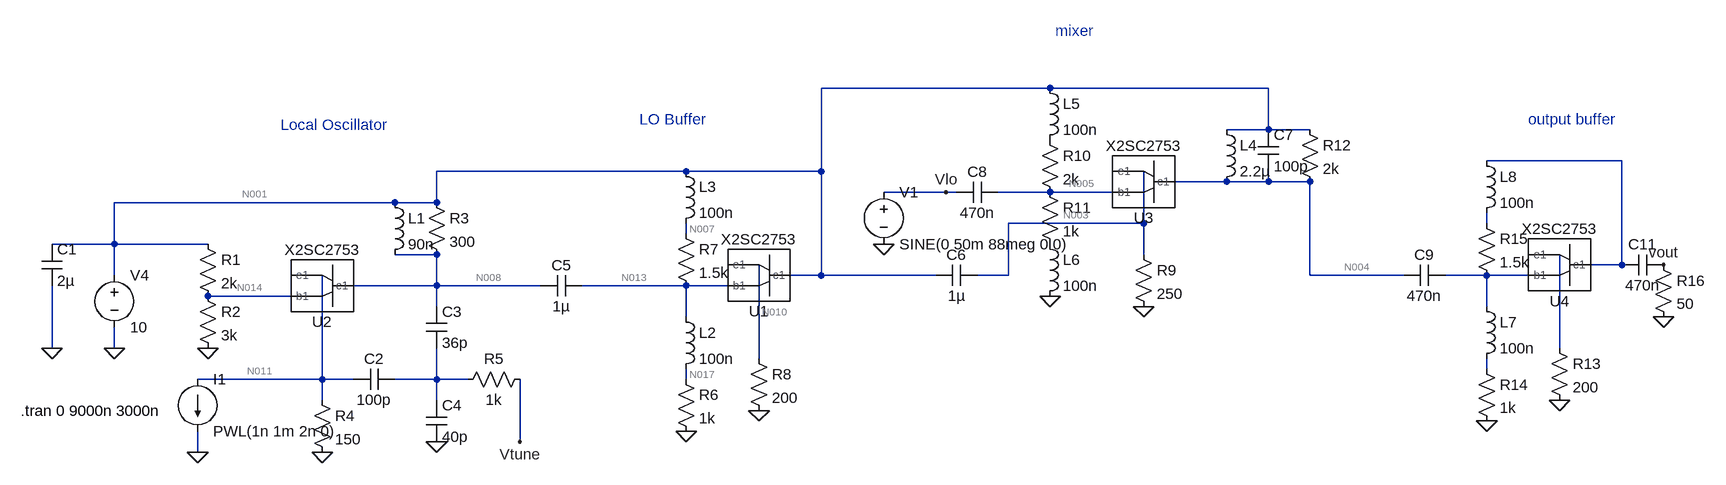
[diagram p0: schematic Lab 3 final.asc]
Lab 3 final.asc, the LTspice schematic file:
Version 4
SHEET 1 3088 680
WIRE 2096 -160 1744 -160
WIRE 2432 -160 2096 -160
WIRE 2432 -96 2432 -160
WIRE 2432 -96 2368 -96
WIRE 2496 -96 2432 -96
WIRE 2976 -48 2768 -48
WIRE 1536 -32 1152 -32
WIRE 1744 -32 1744 -160
WIRE 1744 -32 1536 -32
WIRE 2240 -32 2192 -32
WIRE 2368 -16 2288 -16
WIRE 2432 -16 2432 -32
WIRE 2432 -16 2368 -16
WIRE 2496 -16 2432 -16
WIRE 1936 0 1840 0
WIRE 1952 0 1936 0
WIRE 2096 0 2016 0
WIRE 2192 0 2096 0
WIRE 1088 16 656 16
WIRE 1152 16 1152 -32
WIRE 1152 16 1088 16
WIRE 2240 48 2240 -32
WIRE 2240 48 2032 48
WIRE 2768 48 2768 32
WIRE 1536 64 1536 48
WIRE 656 80 656 16
WIRE 656 80 560 80
WIRE 800 80 656 80
WIRE 1152 96 1088 96
WIRE 2240 96 2240 48
WIRE 2880 96 2832 96
WIRE 1648 112 1600 112
WIRE 2976 112 2976 -48
WIRE 2976 112 2928 112
WIRE 656 128 656 80
WIRE 976 128 928 128
WIRE 1744 128 1744 -32
WIRE 1744 128 1696 128
WIRE 1920 128 1744 128
WIRE 2032 128 2032 48
WIRE 2032 128 1984 128
WIRE 2496 128 2496 -16
WIRE 2640 128 2496 128
WIRE 2768 128 2704 128
WIRE 2832 128 2768 128
WIRE 1152 144 1152 96
WIRE 1152 144 1024 144
WIRE 1312 144 1152 144
WIRE 1536 144 1376 144
WIRE 1600 144 1536 144
WIRE 928 160 800 160
WIRE 1152 176 1152 144
WIRE 2768 176 2768 128
WIRE 1536 192 1536 144
WIRE 560 240 560 144
WIRE 656 240 656 208
WIRE 2880 240 2880 96
WIRE 1648 256 1648 112
WIRE 2768 272 2768 256
WIRE 976 288 976 128
WIRE 976 288 784 288
WIRE 1024 288 976 288
WIRE 1152 288 1152 240
WIRE 1152 288 1088 288
WIRE 1200 288 1152 288
WIRE 1536 288 1536 272
WIRE 976 320 976 288
WIRE 1152 320 1152 288
WIRE 1280 384 1280 288
WIRE 784 400 784 368
FLAG 656 240 0
FLAG 784 400 0
FLAG 800 240 0
FLAG 560 240 0
FLAG 976 400 0
FLAG 1152 384 0
FLAG 1280 384 Vtune
FLAG 1648 336 0
FLAG 1536 368 0
FLAG 2240 176 0
FLAG 1840 80 0
FLAG 2096 160 0
FLAG 2880 320 0
FLAG 2768 352 0
FLAG 3040 192 0
FLAG 3040 112 vout
FLAG 1936 0 Vlo
SYMBOL AutoGenerated\\X2SC2753 976 144 R180
SYMATTR InstName U2
SYMBOL voltage 656 112 R0
WINDOW 123 0 0 Left 0
WINDOW 39 0 0 Left 0
SYMATTR InstName V4
SYMATTR Value 10
SYMBOL current 784 288 R0
WINDOW 123 0 0 Left 0
WINDOW 39 0 0 Left 0
SYMATTR InstName I1
SYMATTR Value PWL(1n 1m 2n 0)
SYMBOL res 784 64 R0
SYMATTR InstName R1
SYMATTR Value 2k
SYMBOL res 784 144 R0
SYMATTR InstName R2
SYMATTR Value 3k
SYMBOL cap 544 80 R0
SYMATTR InstName C1
SYMATTR Value 2µ
SYMBOL ind 1072 0 R0
SYMATTR InstName L1
SYMATTR Value 90n
SYMBOL cap 1136 176 R0
SYMATTR InstName C3
SYMATTR Value 36p
SYMBOL res 960 304 R0
SYMATTR InstName R4
SYMATTR Value 150
SYMBOL cap 1136 320 R0
SYMATTR InstName C4
SYMATTR Value 40p
SYMBOL res 1296 272 R90
WINDOW 0 0 56 VBottom 2
WINDOW 3 32 56 VTop 2
SYMATTR InstName R5
SYMATTR Value 1k
SYMBOL cap 1088 272 R90
WINDOW 0 0 32 VBottom 2
WINDOW 3 32 32 VTop 2
SYMATTR InstName C2
SYMATTR Value 100p
SYMBOL res 1136 0 R0
SYMATTR InstName R3
SYMATTR Value 300
SYMBOL cap 1376 128 R90
WINDOW 0 0 32 VBottom 2
WINDOW 3 32 32 VTop 2
SYMATTR InstName C5
SYMATTR Value 1µ
SYMBOL AutoGenerated\\X2SC2753 1648 128 R180
SYMATTR InstName U1
SYMBOL res 1632 240 R0
SYMATTR InstName R8
SYMATTR Value 200
SYMBOL ind 1520 176 R0
SYMATTR InstName L2
SYMATTR Value 100n
SYMBOL res 1520 272 R0
SYMATTR InstName R6
SYMATTR Value 1k
SYMBOL res 1520 48 R0
SYMATTR InstName R7
SYMATTR Value 1.5k
SYMBOL ind 1520 -48 R0
SYMATTR InstName L3
SYMATTR Value 100n
SYMBOL cap 1984 112 R90
WINDOW 0 0 32 VBottom 2
WINDOW 3 32 32 VTop 2
SYMATTR InstName C6
SYMATTR Value 1µ
SYMBOL AutoGenerated\\X2SC2753 2240 -16 R180
SYMATTR InstName U3
SYMBOL res 2224 80 R0
SYMATTR InstName R9
SYMATTR Value 250
SYMBOL res 2080 -96 R0
SYMATTR InstName R10
SYMATTR Value 2k
SYMBOL res 2080 -16 R0
SYMATTR InstName R11
SYMATTR Value 1k
SYMBOL ind 2352 -112 R0
SYMATTR InstName L4
SYMATTR Value 2.2µ
SYMBOL cap 2416 -96 R0
SYMATTR InstName C7
SYMATTR Value 100p
SYMBOL res 2480 -112 R0
SYMATTR InstName R12
SYMATTR Value 2k
SYMBOL voltage 1840 -16 R0
WINDOW 123 0 0 Left 0
WINDOW 39 0 0 Left 0
SYMATTR InstName V1
SYMATTR Value SINE(0 50m 88meg 0 0)
SYMBOL cap 2016 -16 R90
WINDOW 0 0 32 VBottom 2
WINDOW 3 32 32 VTop 2
SYMATTR InstName C8
SYMATTR Value 470n
SYMBOL ind 2080 -176 R0
SYMATTR InstName L5
SYMATTR Value 100n
SYMBOL ind 2080 64 R0
SYMATTR InstName L6
SYMATTR Value 100n
SYMBOL AutoGenerated\\X2SC2753 2880 112 R180
SYMATTR InstName U4
SYMBOL res 2864 224 R0
SYMATTR InstName R13
SYMATTR Value 200
SYMBOL ind 2752 160 R0
SYMATTR InstName L7
SYMATTR Value 100n
SYMBOL res 2752 256 R0
SYMATTR InstName R14
SYMATTR Value 1k
SYMBOL res 2752 32 R0
SYMATTR InstName R15
SYMATTR Value 1.5k
SYMBOL ind 2752 -64 R0
SYMATTR InstName L8
SYMATTR Value 100n
SYMBOL cap 2704 112 R90
WINDOW 0 0 32 VBottom 2
WINDOW 3 32 32 VTop 2
SYMATTR InstName C9
SYMATTR Value 470n
SYMBOL cap 3040 96 R90
WINDOW 0 0 32 VBottom 2
WINDOW 3 32 32 VTop 2
SYMATTR InstName C11
SYMATTR Value 470n
SYMBOL res 3024 96 R0
SYMATTR InstName R16
SYMATTR Value 50
TEXT 512 336 Left 2 !.tran 0 9000n 3000n
TEXT 912 -104 Left 2 ;Local Oscillator
TEXT 1464 -112 Left 2 ;LO Buffer
TEXT 2104 -248 Left 2 ;mixer
TEXT 2832 -112 Left 2 ;output buffer

The netlist it stands for:
* Lab 3 final.asc
XU2 N008 N014 N011 X2SC2753  ; pins c1 b1 e1
V4 N001 0 10
I1 N011 0 PWL(1n 1m 2n 0)
R1 N001 N014 2k
R2 N014 0 3k
C1 N001 0 2µ
L1 N001 N008 90n
C3 N008 N016 36p
R4 N011 0 150
C4 N016 0 40p
R5 Vtune N016 1k
C2 N016 N011 100p
R3 N001 N008 300
C5 N013 N008 1µ
XU1 N001 N013 N010 X2SC2753  ; pins c1 b1 e1
R8 N010 0 200
L2 N013 N017 100n
R6 N017 0 1k
R7 N007 N013 1.5k
L3 N001 N007 100n
C6 N003 N001 1µ
XU3 N004 N005 N003 X2SC2753  ; pins c1 b1 e1
R9 N003 0 250
R10 P001 N005 2k
R11 N005 P002 1k
L4 N001 N004 2.2µ
C7 N001 N004 100p
R12 N001 N004 2k
V1 Vlo 0 SINE(0 50m 88meg 0 0)
C8 N005 Vlo 470n
L5 N001 P001 100n
L6 P002 0 100n
XU4 N002 N012 N009 X2SC2753  ; pins c1 b1 e1
R13 N009 0 200
L7 N012 N015 100n
R14 N015 0 1k
R15 N006 N012 1.5k
L8 N002 N006 100n
C9 N012 N004 470n
C11 vout N002 470n
R16 vout 0 50
.tran 0 9000n 3000n
* Local Oscillator
* LO Buffer
* mixer
* output buffer
.lib C:/Users/jonathansharir-smith/Desktop/251SPICE/Lab2/narrowband\2SC2753.lib
.backanno
.end

* Results of the author's LTspice run, read from the files saved beside the schematic
* Operating Point, zero values left out:
*   V(n014) = 5.488 V
*   V(n008) = 10 V
*   V(n011) = 4.626 V
*   V(n001) = 10 V
*   V(n013) = 3.882 V
*   V(n010) = 3.042 V
*   V(n017) = 3.882 V
*   V(n007) = 10 V
*   V(n003) = 2.423 V
*   V(n005) = 3.25 V
*   V(n004) = 10 V
*   V(p001) = 10 V
*   V(p002) = 3.25 µV
*   I(L1) = 31.42 mA
*   I(L2) = 3.882 mA
*   I(L3) = 4.079 mA
*   I(L4) = 9.566 mA
*   I(L5) = 3.375 mA
*   I(L6) = 3.25 mA
*   I(I1) = 1 mA
*   I(R1) = 2.256 mA
*   I(R2) = 1.829 mA
*   I(R4) = 30.84 mA
*   I(R3) = 104.7 nA
*   I(R8) = 15.21 mA
*   I(R6) = 3.882 mA
*   I(R7) = 4.079 mA
*   I(R9) = 9.692 mA
*   I(R10) = 3.375 mA
*   I(R11) = 3.25 mA
*   I(R12) = 4.783 nA
*   I(V4) = -65.71 mA
*   Ix(u2:C1) = 31.42 mA
*   Ix(u2:B1) = 426.4 µA
*   Ix(u2:E1) = -31.84 mA
*   Ix(u1:C1) = 15.01 mA
*   Ix(u1:B1) = 196.9 µA
*   Ix(u1:E1) = -15.21 mA
*   Ix(u3:C1) = 9.566 mA
*   Ix(u3:B1) = 125.3 µA
*   Ix(u3:E1) = -9.692 mA